# Altium schematic sheet GSB-01-V00.SchDoc: General Sensor Board
size A3; DrawnBy: Zoe Goodward; Revision: 01; SheetNumber: 1; SheetTotal: 1; Version: 01; Project: Battery Managment System 2020; PageSetup: Record=PageOptions|CenterHorizontal=True|CenterVertical=True|PrintScale=0.97|XCorrection=1.00|YCorrection=1.00|PrintKind=0|BorderSize=5000000|LeftOffset=0|BottomOffset=0|Orientation=2|PaperLength=1000|PaperWidth=1000|Scale=100|PaperSource=7|PrintQuality=-4|MediaType=1|DitherType=10|PaperKind=A4|PrintScaleMode=1
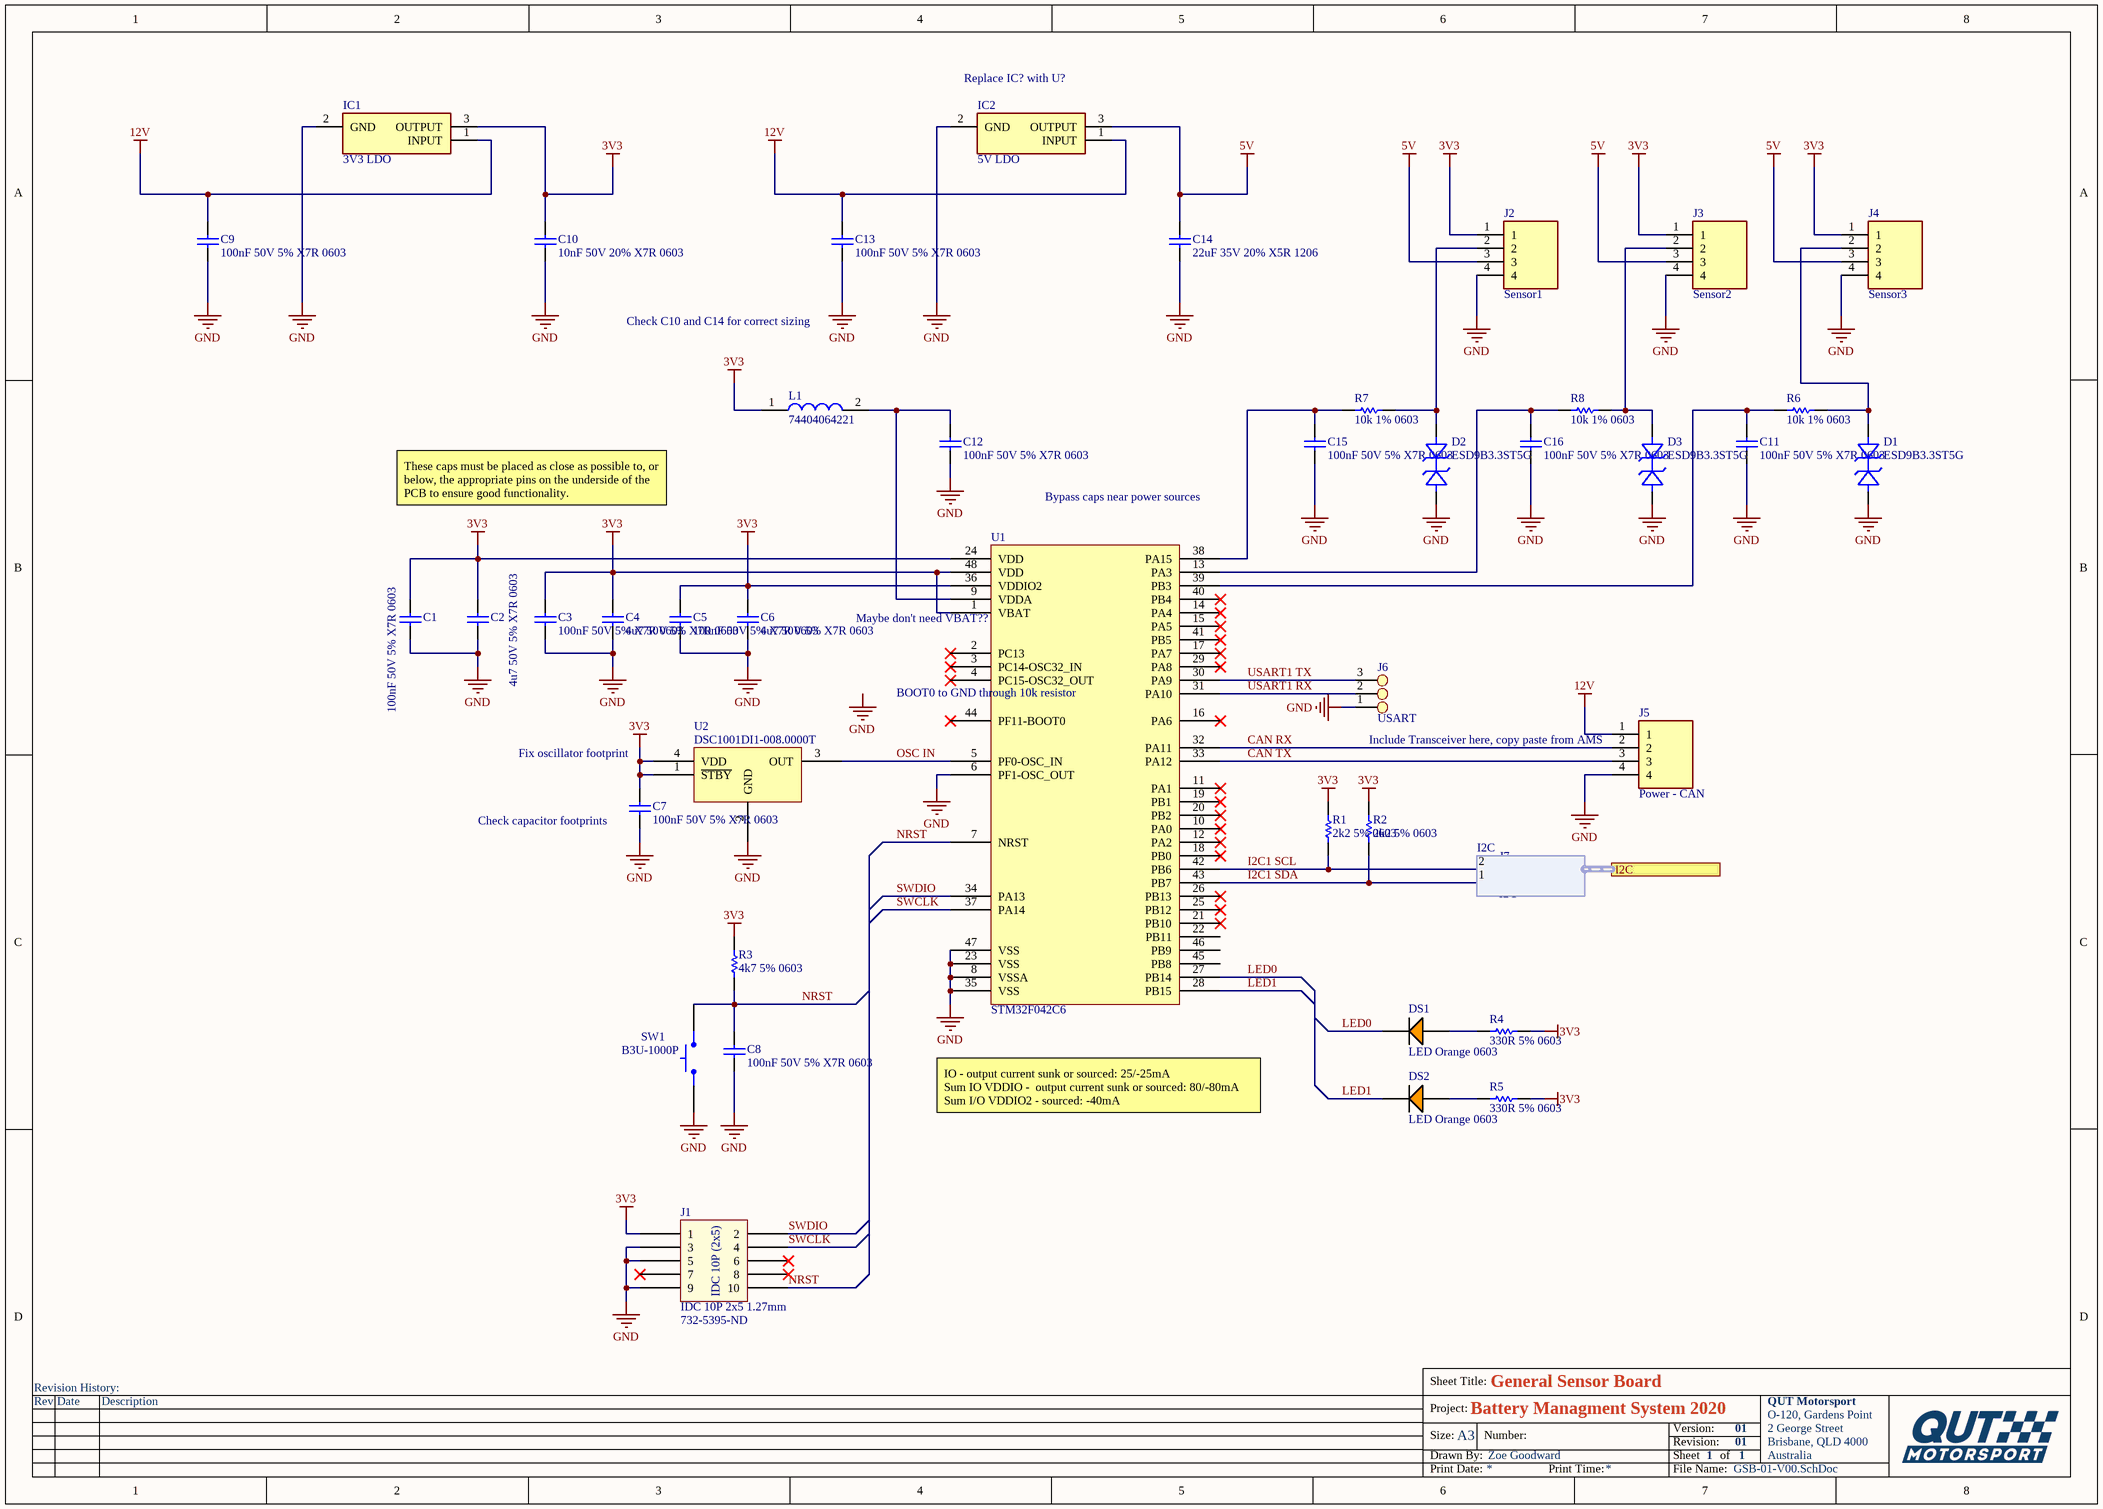
[diagram p0: GSB-01-V00.SchDoc]

## Parts
C1  100nF 50V 5% X7R 0603  [Cap_Ceramic_0603]
C2  4u7 50V 5% X7R 0603  [Cap_Ceramic_0603]
C3  100nF 50V 5% X7R 0603  [Cap_Ceramic_0603]
C4  4u7 50V 5% X7R 0603  [Cap_Ceramic_0603]
C5  100nF 50V 5% X7R 0603  [Cap_Ceramic_0603]
C6  4u7 50V 5% X7R 0603  [Cap_Ceramic_0603]
C7  100nF 50V 5% X7R 0603  [Cap_Ceramic_0603]
C8  100nF 50V 5% X7R 0603  [Cap_Ceramic_0603]
C9  100nF 50V 5% X7R 0603  [Cap_Ceramic_0603]
C10  10nF 50V 20% X7R 0603  [Cap_Ceramic_0603]
C11  100nF 50V 5% X7R 0603  [Cap_Ceramic_0603]
C12  100nF 50V 5% X7R 0603  [Cap_Ceramic_0603]
C13  100nF 50V 5% X7R 0603  [Cap_Ceramic_0603]
C14  22uF 35V 20% X5R 1206  [Cap_Ceramic_1206]
C15  100nF 50V 5% X7R 0603  [Cap_Ceramic_0603]
C16  100nF 50V 5% X7R 0603  [Cap_Ceramic_0603]
D1  ESD9B3.3ST5G  [SOD-923]
D2  ESD9B3.3ST5G  [SOD-923]
D3  ESD9B3.3ST5G  [SOD-923]
DS1  LED Orange 0603  [LED ORANGE 0603]
DS2  LED Orange 0603  [LED ORANGE 0603]
IC1  3V3 LDO  [NCV4274CDT50RKG]
IC2  5V LDO  [NCV4274CDT50RKG]
J1  IDC 10P 2x5 1.27mm  [IDC 1.27MM 10P]
J2  Sensor1  [MOLEX_0436500400]
J3  Sensor2  [MOLEX_0436500400]
J4  Sensor3  [MOLEX_0436500400]
J5  Power - CAN  [MOLEX_0436500400]
J6  USART  [Jumper_3Way_Pin]
J7  I2C  [Jumper_2Way_Pin]
L1  74404064221  [Inductor_6x6mm]
R1  2k2 5% 0603  [Res_ThinFilm_0603]
R2  2k2 5% 0603  [Res_ThinFilm_0603]
R3  4k7 5% 0603  [Res_ThinFilm_0603]
R4  330R 5% 0603  [Res_ThinFilm_0603]
R5  330R 5% 0603  [Res_ThinFilm_0603]
R6  10k 1% 0603  [Res_ThinFilm_0603]
R7  10k 1% 0603  [Res_ThinFilm_0603]
R8  10k 1% 0603  [Res_ThinFilm_0603]
SW1  B3U-1000P  [BTN B3U-1000P]
U1  STM32F042C6  [STM32F042C6]
U2  DSC1001DI1-008.0000T  [DSC1001DI1-008.0000TCT-ND]

## Ports
I2C (harness I2C)

## Harnesses
I2C: 

## Nets
3V3: C1.2 C2.2 C3.2 C4.2 C5.2 C6.2 C7.2 C10.2 IC1.3(OUTPUT) J1.1 J2.1 J3.1 J4.1 L1.1 R1.2 R2.2 R3.2 R4.2 R5.2 U1.1(VBAT) U1.24(VDD) U1.36(VDDIO2) U1.48(VDD) U2.1(~{STBY}) U2.4(VDD)
5V: C14.2 IC2.3(OUTPUT) J2.3 J3.3 J4.3
12V: C9.2 C13.2 IC1.1(INPUT) IC2.1(INPUT) J5.1
GND: C1.1 C2.1 C3.1 C4.1 C5.1 C6.1 C7.1 C8.1 C9.1 C10.1 C11.1 C12.1 C13.1 C14.1 C15.1 C16.1 D1.1 D2.1 D3.1 IC1.2(GND) IC2.2(GND) J1.3 J1.5 J1.9 J2.4 J3.4 J4.4 J5.4 J6.1 SW1.1 U1.6(PF1-OSC_OUT) U1.8(VSSA) U1.23(VSS) U1.35(VSS) U1.47(VSS) U2.2(GND)
CAN RX: J5.2 U1.32(PA11)
CAN TX: J5.3 U1.33(PA12)
I2C1 SCL: J7.2 R1.1 U1.42(PB6)
I2C1 SDA: J7.1 R2.1 U1.43(PB7)
LED0: DS1.2(C) U1.27(PB14)
LED1: DS2.2(C) U1.28(PB15)
NRST: C8.2 J1.10 R3.1 SW1.2 U1.7(NRST)
OSC IN: U1.5(PF0-OSC_IN) U2.3(OUT)
SWCLK: J1.4 U1.37(PA14)
SWDIO: J1.2 U1.34(PA13)
USART1 RX: J6.2 U1.31(PA10)
USART1 TX: J6.3 U1.30(PA9)
NetC11_2: C11.2 R6.1 U1.39(PB3)
NetC12_2: C12.2 L1.2 U1.9(VDDA)
NetC15_2: C15.2 R7.1 U1.38(PA15)
NetC16_2: C16.2 R8.1 U1.13(PA3)
NetD1_2: D1.2 J4.2 R6.2
NetD2_2: D2.2 J2.2 R7.2
NetD3_2: D3.2 J3.2 R8.2
NetDS1_1: DS1.1(A) R4.1
NetDS2_1: DS2.1(A) R5.1

Not connected (* = marked no-connect by the designer): J1 6* 7* 8*; U1 2(PC13)* 3(PC14-OSC32_IN)* 4(PC15-OSC32_OUT)* 10(PA0)* 11(PA1)* 12(PA2)* 14(PA4)* 15(PA5)* 16(PA6)* 17(PA7)* 18(PB0)* 19(PB1)* 20(PB2)* 21(PB10)* 22(PB11) 25(PB12)* 26(PB13)* 29(PA8)* 40(PB4)* 41(PB5)* 44(PF11-BOOT0)* 45(PB8) 46(PB9)

## Notes on the sheet
- (near IC2) Replace IC? with U?
- Check C10 and C14 for correct sizing
- These caps must be placed as close as possible to, or below, the appropriate pins on the underside of the PCB to ensure good functionality.
- Bypass caps near power sources
- (near U1) Maybe don't need VBAT??
- (near U1) BOOT0 to GND through 10k resistor
- Fix oscillator footprint
- (near J5) Include Transceiver here, copy paste from AMS
- (near C7) Check capacitor footprints
- IO - output current sunk or sourced: 25/-25mA
  Sum IO VDDIO -  output current sunk or sourced: 80/-80mA
  Sum I/O VDDIO2 - sourced: -40mA
- (near J1) 732-5395-ND
- Labels drawn without touching a wire or pin: GND
- Revision History:
- Sheet Title:
- Rev
- Date
- Description
- Project:
- Size:
- Drawn By:
- A3
- Number:
- Revision:
- Sheet
- Version:
- of
- QUT Motorsport
- O-120, Gardens Point
- 2 George Street
- Brisbane, QLD 4000
- Australia
- Print Date:
- Print Time:
- File Name:
- (in symbol IDC 10P 2x5 1.27mm) IDC 10P (2x5)

## Library data of the parts
C1 C3 C5 C7-C9 C11-C13 C15 C16 = 100nF 50V 5% X7R 0603: Capacitor, Ceramic, SMD, 100nF, 50V, 5%, X7R, 0603
C2 C4 C6 = 4u7 50V 5% X7R 0603: Capacitor, Ceramic, SMD, 4u7, 50V, 5%, X7R, 0603
C10 = 10nF 50V 20% X7R 0603: 10000pF ±20% 50V Ceramic Capacitor X7R 0603 (1608 Metric); ComponentLink1Description: Digikey; ComponentLink1URL: https://www.digikey.com.au/product-detail/en/kemet/C0603C103M5RACTU/399-7842-1-ND/3471565; ComponentLink2Description: Datasheet; ComponentLink2URL: https://content.kemet.com/datasheets/KEM_C1002_X7R_SMD.pdf
C14 = 22uF 35V 20% X5R 1206: 22µF ±20% 35V Ceramic Capacitor X5R 1206 (3216 Metric); ComponentLink1Description: Digikey; ComponentLink1URL: https://www.digikey.com.au/product-detail/en/tdk-corporation/C3216X5R1V226M160AC/445-8045-1-ND/2792165; ComponentLink2Description: Datasheet; ComponentLink2URL: https://product.tdk.com/info/en/catalog/datasheets/mlcc_commercial_general_en.pdf
D1-D3 = ESD9B3.3ST5G: 11.5V Clamp 2A (8/20µs) Ipp Tvs Diode Surface Mount SOD-923; Manufacturer: ON Semiconductor; MPN: ESD9B3.3ST5G; ComponentLink1Description: Digikey; ComponentLink1URL: https://www.digikey.com.au/product-detail/en/on-semiconductor/ESD9B3.3ST5G/ESD9B3.3ST5GOSCT-ND/2704995; ComponentLink2Description: Datasheet; ComponentLink2URL: https://www.onsemi.cn/pub/Collateral/ESD9B-D.PDF
IC1 IC2 = NCV4274CDT50RKG: Integrated Circuit; Manufacturer_Name: ON Semiconductor; Datasheet Link: https://www.onsemi.com/pub/Collateral/NCV4274C-D.PDF; Height: 2.38mm; Manufacturer_Part_Number: NCV4274CDT50RKG; Arrow Part Number: NCV4274CDT50RKG; Arrow Price/Stock: https://www.arrow.com/en/products/ncv4274cdt50rkg/on-semiconductor; Mouser Part Number: 863-NCV4274CDT50RKG; Mouser Price/Stock: https://www.mouser.co.uk/ProductDetail/ON-Semiconductor/NCV4274CDT50RKG?qs=tCMd4XlZ%2FiBk5MdmOBr7cw%3D%3D
J2-J5 = 0436500400: Micro-fit 3.0 Connector, 4 Circuit Single Row, Right Angle Throughhole PCB, Snap-In Peg; MF: Molex; MP: 0436500400; SnapEDA_Link: https://www.snapeda.com/parts/0436500400/Molex/view-part/1776823/?ref=snap; Price: None; Package: None; Availability: Unavailable; Value: *; ComponentLink1Description: Snapeda; ComponentLink1URL: https://www.snapeda.com/parts/0436500400/Molex/view-part/1776823/?ref=eda
J6 = Jumper 3Way Side Pins
J7 = Jumper 2Way Side Pins
L1 = 74404064221: FIXED IND 220UH 660MA 850 MOHM; ComponentLink1Description: Digikey; ComponentLink1URL: https://www.digikey.com.au/product-detail/en/w%C3%BCrth-elektronik/74404064221/732-7261-1-ND/5353241; ComponentLink2Description: LCSC A; ComponentLink2URL: https://lcsc.com/product-detail/Power-Inductors_Sunlord-SWPA6045S221MT_C91047.html; ComponentLink3Description: LCSC B; ComponentLink3URL: https://lcsc.com/product-detail/Power-Inductors_SXN-Shun-Xiang-Nuo-Elec-SMNR6045-221MT_C467145.html
R1 R2 = 2k2 5% 0603: Resistor, SMD, 2k2, 0.1W, 5%, 0603
R3 = 4k7 5% 0603: Resistor, SMD, 4k7, 0.1W, 5%, 0603
R4 R5 = 330R 5% 0603: Resistor, SMD, 330R, 0.1W, 5%, 0603
R6-R8 = 10k 1% 0603: Resistor, SMD, 10k, 0.1W, 1%, 0603
SW1 = BTN B3U-1000P: Omron B3U-1000P Ultra Miniture Switch; ComponentLink1Description: LCSC; ComponentLink1URL: https://lcsc.com/product-detail/Tactile-Switches_BRIGHT-TSA063G50-250_C294565.html
U1 = STM32042C6: ARM® Cortex®-M0 STM32F0 Microcontroller IC 32-Bit 48MHz 32KB (32K x 8) FLASH 48-LQFP (7x7); ComponentLink1Description: Digikey; ComponentLink1URL: https://www.digikey.com.au/product-detail/en/stmicroelectronics/STM32F042C6T6TR/497-19319-1-ND/10063344; ComponentLink2Description: Datasheet; ComponentLink2URL: https://www.st.com/resource/en/datasheet/stm32f042k6.pdf
U2 = DSC1001DI1-008.0000T: 8MHz XO (Standard) CMOS Oscillator 1.8 ~ 3.3V Standby (Power Down) 4-SMD, No Lead